# Altium schematic sheet fly.SchDoc
size 304 x 203 mm; SheetNumber: 1; SheetTotal: 1
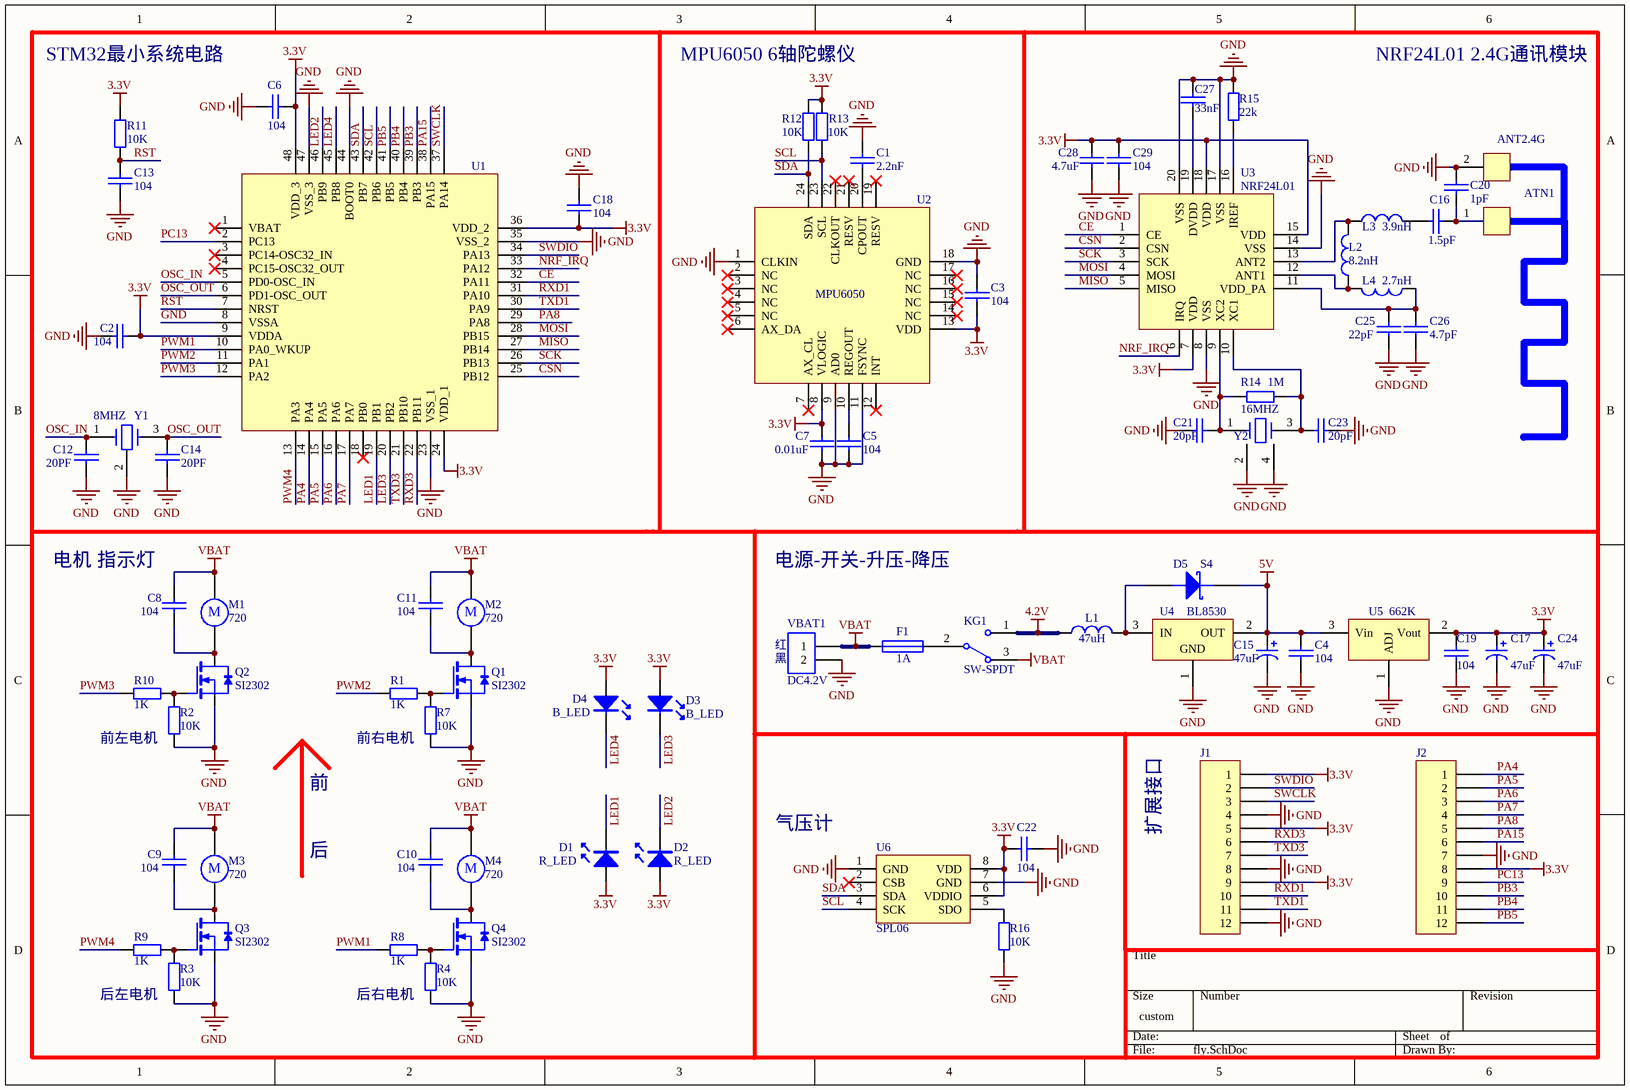
[diagram p0: fly.SchDoc]

## Parts
ATN1  ANT2.4G  [ANT2.4G_1]
C1  2.2nF  [C_0603]
C2  104  [C_0603]
C3  104  [C_0603]
C4  104  [C_0603]
C5  104  [C_0603]
C6  104  [C_0603]
C7  0.01uF  [C_0603]
C8  104  [C_0603]
C9  104  [C_0603]
C10  104  [C_0603]
C11  104  [C_0603]
C12  20PF  [C_0603]
C13  104  [C_0603]
C14  20PF  [C_0603]
C15  47uF  [C_1206]
C16  1.5pF  [C_0603]
C17  47uF  [C_1206]
C18  104  [C_0603]
C19  104  [C_0603]
C20  1pF  [C_0603]
C21  20pF  [C_0603]
C22  104  [C_0603]
C23  20pF  [C_0603]
C24  47uF  [C_1206]
C25  22pF  [C_0603]
C26  4.7pF  [C_0603]
C27  33nF  [C_0603]
C28  4.7uF  [C_0603]
C29  104  [C_0603]
D1  R_LED  [LED0603]
D2  R_LED  [LED0603]
D3  B_LED  [LED0603]
D4  B_LED  [LED0603]
D5  S4  [SOD-123]
F1  1A  [FU 0805]
J1  12P 2.54MM  [HDR2.54-LI-12P]  (value not drawn)
J2  12P 2.54MM  [HDR2.54-LI-12P]  (value not drawn)
KG1  SW-SPDT  [TPKG]
L1  47uH  [L_CD43]
L2  8.2nH  [L_0603]
L3  3.9nH  [L_0603]
L4  2.7nH  [L_0603]
M1  720  [HDR2.54-LI-2P]
M2  720  [HDR2.54-LI-2P]
M3  720  [HDR2.54-LI-2P]
M4  720  [HDR2.54-LI-2P]
Q1  SI2302  [SOT23]
Q2  SI2302  [SOT23]
Q3  SI2302  [SOT23]
Q4  SI2302  [SOT23]
R1  1K  [R_0603]
R2  10K  [R_0603]
R3  10K  [R_0603]
R4  10K  [R_0603]
R7  10K  [R_0603]
R8  1K  [R_0603]
R9  1K  [R_0603]
R10  1K  [R_0603]
R11  10K  [R_0603]
R12  10K  [R_0603]
R13  10K  [R_0603]
R14  1M  [R_0603]
R15  22k  [R_0603]
R16  10K  [R_0603]
U1  STM32F103C8T6_LQFP48  [LQFP48_STM32]  (value not drawn)
U2  MPU6050  [QFN24]
U3  NRF24L01  [LQFP32]
U4  BL8530  [SOT-89]
U5  662K  [SOT23-PIN132]
U6  SPL06  [SMD_SPL06]
VBAT1  DC4.2V  [HDR2.54-WI-2P]
Y1  8MHZ  [Y3213]
Y2  16MHZ  [OSC 3225-4P]

## Nets
3.3V: C2.2 C3.1 C6.1 C7.2 C17.1 C18.1 C19.2 C22.1 C24.1 C28.2 C29.2 D1.1 D2.1 D3.1 D4.1 J1.1 J1.5 J1.9 J2.8 R11.2 R12.2 R13.2 U1.9(VDDA) U1.24(VDD_1) U1.36(VDD_2) U1.48(VDD_3) U2.8(VLOGIC) U2.13(VDD) U3.7(VDD) U3.15(VDD) U3.18(VDD) U5.2(Vout) U6.6(VDDIO) U6.8(VDD)
4.2V: KG1.1 L1.1
5V: C4.2 C15.1 D5.2(K) U4.2(OUT) U5.3(Vin)
GND: ATN1.2 C1.2 C2.1 C3.2 C4.1 C5.1 C6.2 C7.1 C12.2 C13.2 C14.1 C15.2 C17.2 C18.2 C19.1 C20.2 C21.1 C22.2 C23.2 C24.2 C25.2 C26.2 C27.1 C28.1 C29.1 J1.4 J1.8 J1.12 J2.7 Q1.3(S) Q2.3(S) Q3.3(S) Q4.3(S) R2.1 R3.1 R4.1 R7.1 R15.2 R16.1 U1.8(VSSA) U1.23(VSS_1) U1.35(VSS_2) U1.44(BOOT0) U1.47(VSS_3) U2.1(CLKIN) U2.9(AD0) U2.11(FSYNC) U2.18(GND) U3.8(VSS) U3.14(VSS) U3.17(VSS) U3.20(VSS) U4.1(GND) U5.1(ADJ) U6.1(GND) U6.7(GND) VBAT1.1(2) Y1.2 Y2.2 Y2.4
VBAT: C8.2 C9.2 C10.2 C11.2 F1.1 KG1.3 M1.1 M2.1 M3.1 M4.1 VBAT1.2(1)
CE: U1.32(PA11) U3.1(CE)
CSN: U1.25(PB12) U3.2(CSN)
LED1: D1.2 U1.19(PB1)
LED2: D2.2 U1.46(PB9)
LED3: D3.2 U1.20(PB2)
LED4: D4.2 U1.45(PB8)
MISO: U1.27(PB14) U3.5(MISO)
MOSI: U1.28(PB15) U3.4(MOSI)
NRF_IRQ: U1.33(PA12) U3.6(IRQ)
OSC_IN: C12.1 U1.5(PD0-OSC_IN) Y1.1
OSC_OUT: C14.2 U1.6(PD1-OSC_OUT) Y1.3
PA4: J2.1 U1.14(PA4)
PA5: J2.2 U1.15(PA5)
PA6: J2.3 U1.16(PA6)
PA7: J2.4 U1.17(PA7)
PA8: J2.5 U1.29(PA8)
PA15: J2.6 U1.38(PA15)
PB3: J2.10 U1.39(PB3)
PB4: J2.11 U1.40(PB4)
PB5: J2.12 U1.41(PB5)
PC13: J2.9 U1.2(PC13)
PWM1: R8.2 U1.10(PA0_WKUP)
PWM2: R1.2 U1.11(PA1)
PWM3: R10.2 U1.12(PA2)
PWM4: R9.2 U1.13(PA3)
RST: C13.1 R11.1 U1.7(NRST)
RXD1: J1.10 U1.31(PA10)
RXD3: J1.6 U1.22(PB11)
SCK: U1.26(PB13) U3.3(SCK)
SCL: R13.1 U1.42(PB6) U2.23(SCL) U6.4(SCK)
SDA: R12.1 U1.43(PB7) U2.24(SDA) U6.3(SDA)
SWCLK: J1.3 U1.37(PA14)
SWDIO: J1.2 U1.34(PA13)
TXD1: J1.11 U1.30(PA9)
TXD3: J1.7 U1.21(PB10)
NetATN1_1: ATN1.1 C16.1 C20.1
NetC1_1: C1.1 U2.20(CPOUT)
NetC5_2: C5.2 U2.10(REGOUT)
NetC8_1: C8.1 M1.2 Q2.2(D)
NetC9_1: C9.1 M3.2 Q3.2(D)
NetC10_1: C10.1 M4.2 Q4.2(D)
NetC11_1: C11.1 M2.2 Q1.2(D)
NetC16_2: C16.2 L3.2
NetC21_2: C21.2 R14.2 U3.9(XC2) Y2.1
NetC23_1: C23.1 R14.1 U3.10(XC1) Y2.3
NetC25_1: C25.1 C26.1 L4.1 U3.11(VDD_PA)
NetC27_2: C27.2 U3.19(DVDD)
NetD5_1: D5.1(A) L1.2 U4.3(IN)
NetF1_2: F1.2 KG1.2
NetL2_1: L2.1 L4.2 U3.12(ANT1)
NetL2_2: L2.2 L3.1 U3.13(ANT2)
NetQ1_1: Q1.1(G) R1.1 R7.2
NetQ2_1: Q2.1(G) R2.2 R10.1
NetQ3_1: Q3.1(G) R3.2 R9.1
NetQ4_1: Q4.1(G) R4.2 R8.1
NetR15_1: R15.1 U3.16(IREF)
NetR16_2: R16.2 U6.5(SDO)

Not connected (* = marked no-connect by the designer): U1 1(VBAT)* 3(PC14-OSC32_IN)* 4(PC15-OSC32_OUT)* 18(PB0)*; U2 2(NC)* 3(NC)* 4(NC)* 5(NC)* 6(AX_DA)* 7(AX_CL)* 12(INT)* 14(NC)* 15(NC)* 16(NC)* 17(NC)* 19(RESV)* 21(RESV)* 22(CLKOUT)*; U6 2(CSB)*

## Notes on the sheet
- STM32最小系统电路
- MPU6050 6轴陀螺仪
- NRF24L01 2.4G通讯模块
- 电机 指示灯
- 电源-开关-升压-降压
- (near VBAT1) 红
- (near VBAT1) 黑
- 前左电机
- 前右电机
- 前
- 气压计
- 扩展接口
- 后
- 后左电机
- 后右电机
- (in symbol Motor) M

## Library data of the parts
ATN1 = ANT2.4G_2
C1-C14 C16 C18-C23 C25-C29 = CAP: Capacitor
C15 C17 C24 = Cap Pol: Polarized Capacitor (Radial); Value: 100pF; Published: 8-Jun-2000; LatestRevisionDate: 17-Jul-2002; LatestRevisionNote: Re-released for DXP Platform.; PackageReference: RB7.6-15; Publisher: Altium Limited; PackageDescription: Polarized Capacitor (Radial); 2 Leads
D1-D4 = LED
D5 = DIODE SCHOTTKY: Schottky Diode
F1 = FUSE1: Fuse
J1 J2 = Header 12: Header, 8-Pin; LatestRevisionDate: 17-Jul-2002; LatestRevisionNote: Re-released for DXP Platform.; Publisher: Altium Limited
KG1 = SW-SPDT: SPDT Subminiature Toggle Switch, Right Angle Mounting, Vertical Actuation; Published: 24-Mar-1999; LatestRevisionDate: 17-Dec-2003; LatestRevisionNote: Schematic revised, PCB Footprint replaced.; DatasheetVersion: 05-Dec-2000; PackageReference: TL36WW15050; Publisher: Altium Limited; PackageDescription: Switch; 4 Leads; ComponentLink1Description: Manufacturer Link; ComponentLink1URL: http://www.apem.com
L1-L4 = Inductor Chip: Inductor; Published: 8-Jun-2000; Revision: July-2002: Re-released for DXP Platform.; Publisher: Altium Limited
  L1: Value: 47uH
  L2: Value: 8.2nH
  L3: Value: 3.9nH
  L4: Value: 2.7nH
M1-M4 = Motor: Motor, General Kind; Published: 24-Mar-1999; LatestRevisionDate: 17-Jul-2002; LatestRevisionNote: Re-released for DXP Platform.; PackageReference: RB5-10.5; Publisher: Altium Limited; PackageDescription: Capacitor (Radial); 2 Leads
Q1-Q4 = N_MOS: N-Channel MOSFET
R1 R8-R10 R14 R15 = Res2: Resistor; Value: 10K; Published: 8-Jun-2000; LatestRevisionDate: 17-Jul-2002; LatestRevisionNote: Re-released for DXP Platform.; Publisher: Altium Limited
R2-R4 R7 R11-R13 R16 = Res2: Resistor; Published: 8-Jun-2000; LatestRevisionDate: 17-Jul-2002; LatestRevisionNote: Re-released for DXP Platform.; Publisher: Altium Limited; Value: 10K
U1 = STM32_LQFP48
U4 = HT7750: POSITIVE OUTPUT VOLTAGE
U5 = LM317: 3-Terminal Adjustable Positive Voltage Regulator
VBAT1 = CON2: Connector
Y1 = Y
Y2 = Y_1